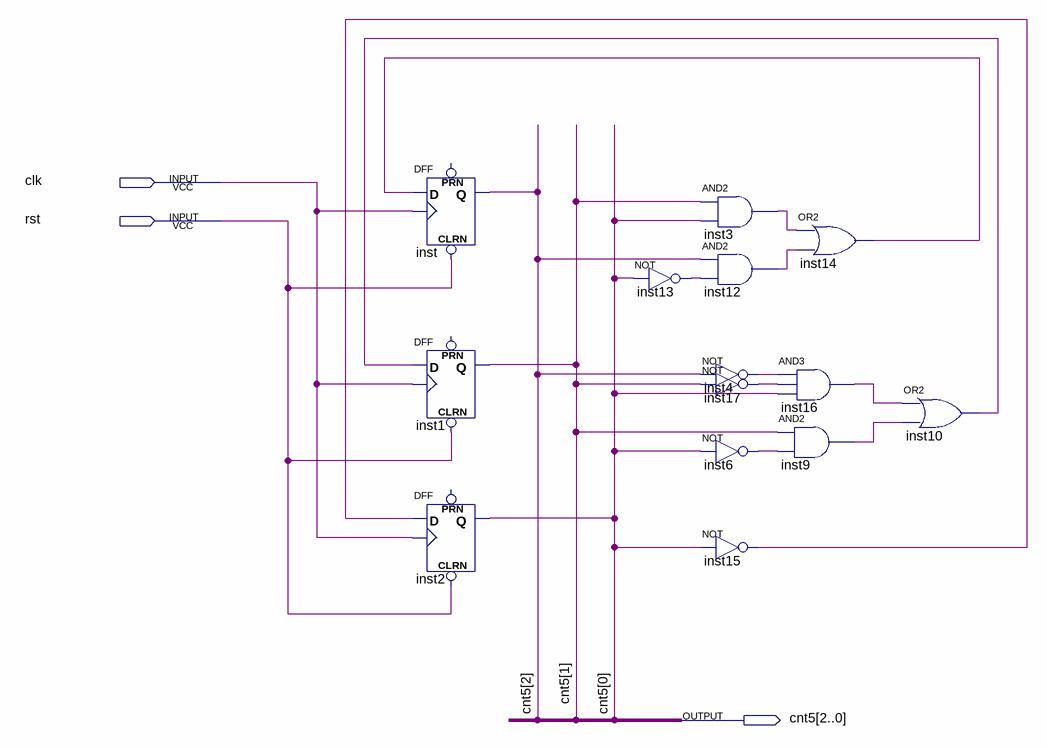
[diagram p0: schematic sheet]
// Quartus schematic five_counter.bdf as structural Verilog: 14 symbols, 3 pins
module five_counter (
  input  clk,
  input  rst,
  output [2:0] cnt5
);

  wire inst3_out, inst4_out, inst6_out, inst9_out, inst10_out, inst12_out, inst13_out, inst14_out,
       inst15_out, inst16_out, inst17_out;

  DFF inst (.CLRN(rst), .CLK(clk), .D(inst14_out), .Q(cnt5[2]));  // open: PRN
  DFF inst1 (.CLRN(rst), .CLK(clk), .D(inst10_out), .Q(cnt5[1]));  // open: PRN
  DFF inst2 (.CLRN(rst), .CLK(clk), .D(inst15_out), .Q(cnt5[0]));  // open: PRN
  not inst13 (inst13_out, cnt5[0]);
  and inst3 (inst3_out, cnt5[1], cnt5[0]);
  and inst12 (inst12_out, cnt5[2], inst13_out);
  not inst4 (inst4_out, cnt5[2]);
  not inst17 (inst17_out, cnt5[1]);
  not inst6 (inst6_out, cnt5[0]);
  not inst15 (inst15_out, cnt5[0]);
  or inst14 (inst14_out, inst3_out, inst12_out);
  and inst16 (inst16_out, inst4_out, inst17_out, cnt5[0]);
  and inst9 (inst9_out, cnt5[1], inst6_out);
  or inst10 (inst10_out, inst16_out, inst9_out);
endmodule
